# EAGLE schematic CN-Cape002 (EAGLE 7.2.0)

## Sheet 1 of 5: Spannungsversorgung Verpolungsschutz ? Größe der Sicherung ? 1A oder 3A für Servos?
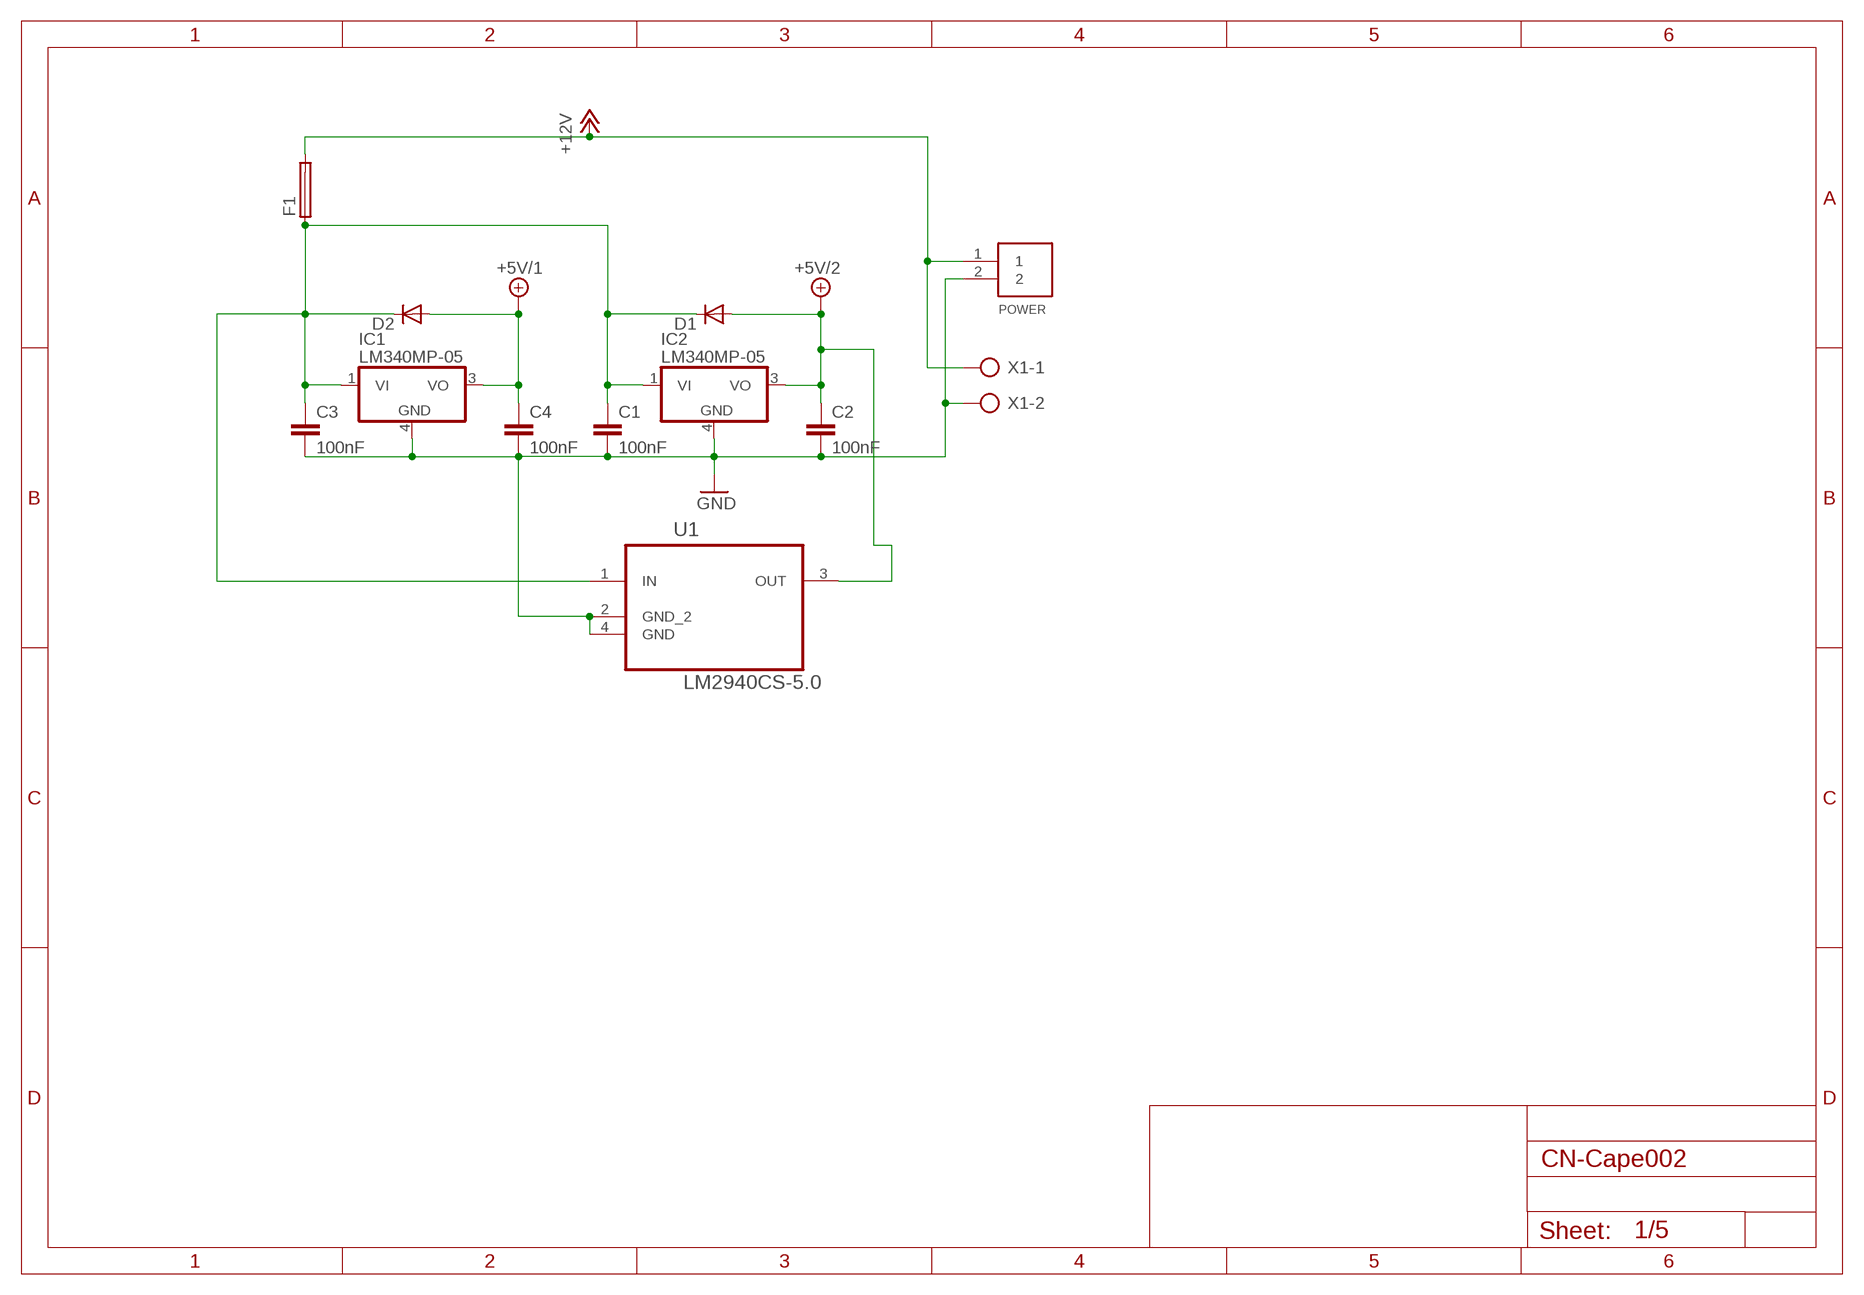
[diagram p0: schematic, sheet 1]

### Parts
C1  100nF  C-EUC0805  [C0805]
C2  100nF  C-EUC0805  [C0805]
C3  100nF  C-EUC0805  [C0805]
C4  100nF  C-EUC0805  [C0805]
D1  DIODE-SOD123  [SOD123]
D2  DIODE-SOD123  [SOD123]
F1  SH22,5  [SH22,5]
IC1  LM340MP-05  [SOT223]
IC2  LM340MP-05  [SOT223]
POWER  S2PIN  [S2B-EH]
U1  LM2940CS-5.0  [TO254P1435X464-4N]
X1  AK500/2-H  [AK500/2-H]

### Nets
12V_FUSED: C1.1 C3.1 D1.C D2.C F1.1 IC1.1(VI) IC2.1(VI) U1.1(IN)
+5V/1: C4.1 D2.A IC1.3(VO) ; also sheet 2,3,4
+5V/2: C2.1 D1.A IC2.3(VO) U1.3(OUT) ; also sheet 4,5
+12V: F1.2 POWER.1 X1.1
GND: C1.2 C2.2 C3.2 C4.2 IC1.4(GND) IC2.4(GND) POWER.2 U1.2(GND_2) U1.4(GND) X1.2 ; also sheet 2,3,4,5

## Sheet 2 of 5: BeagleBoard Black Expansion Header
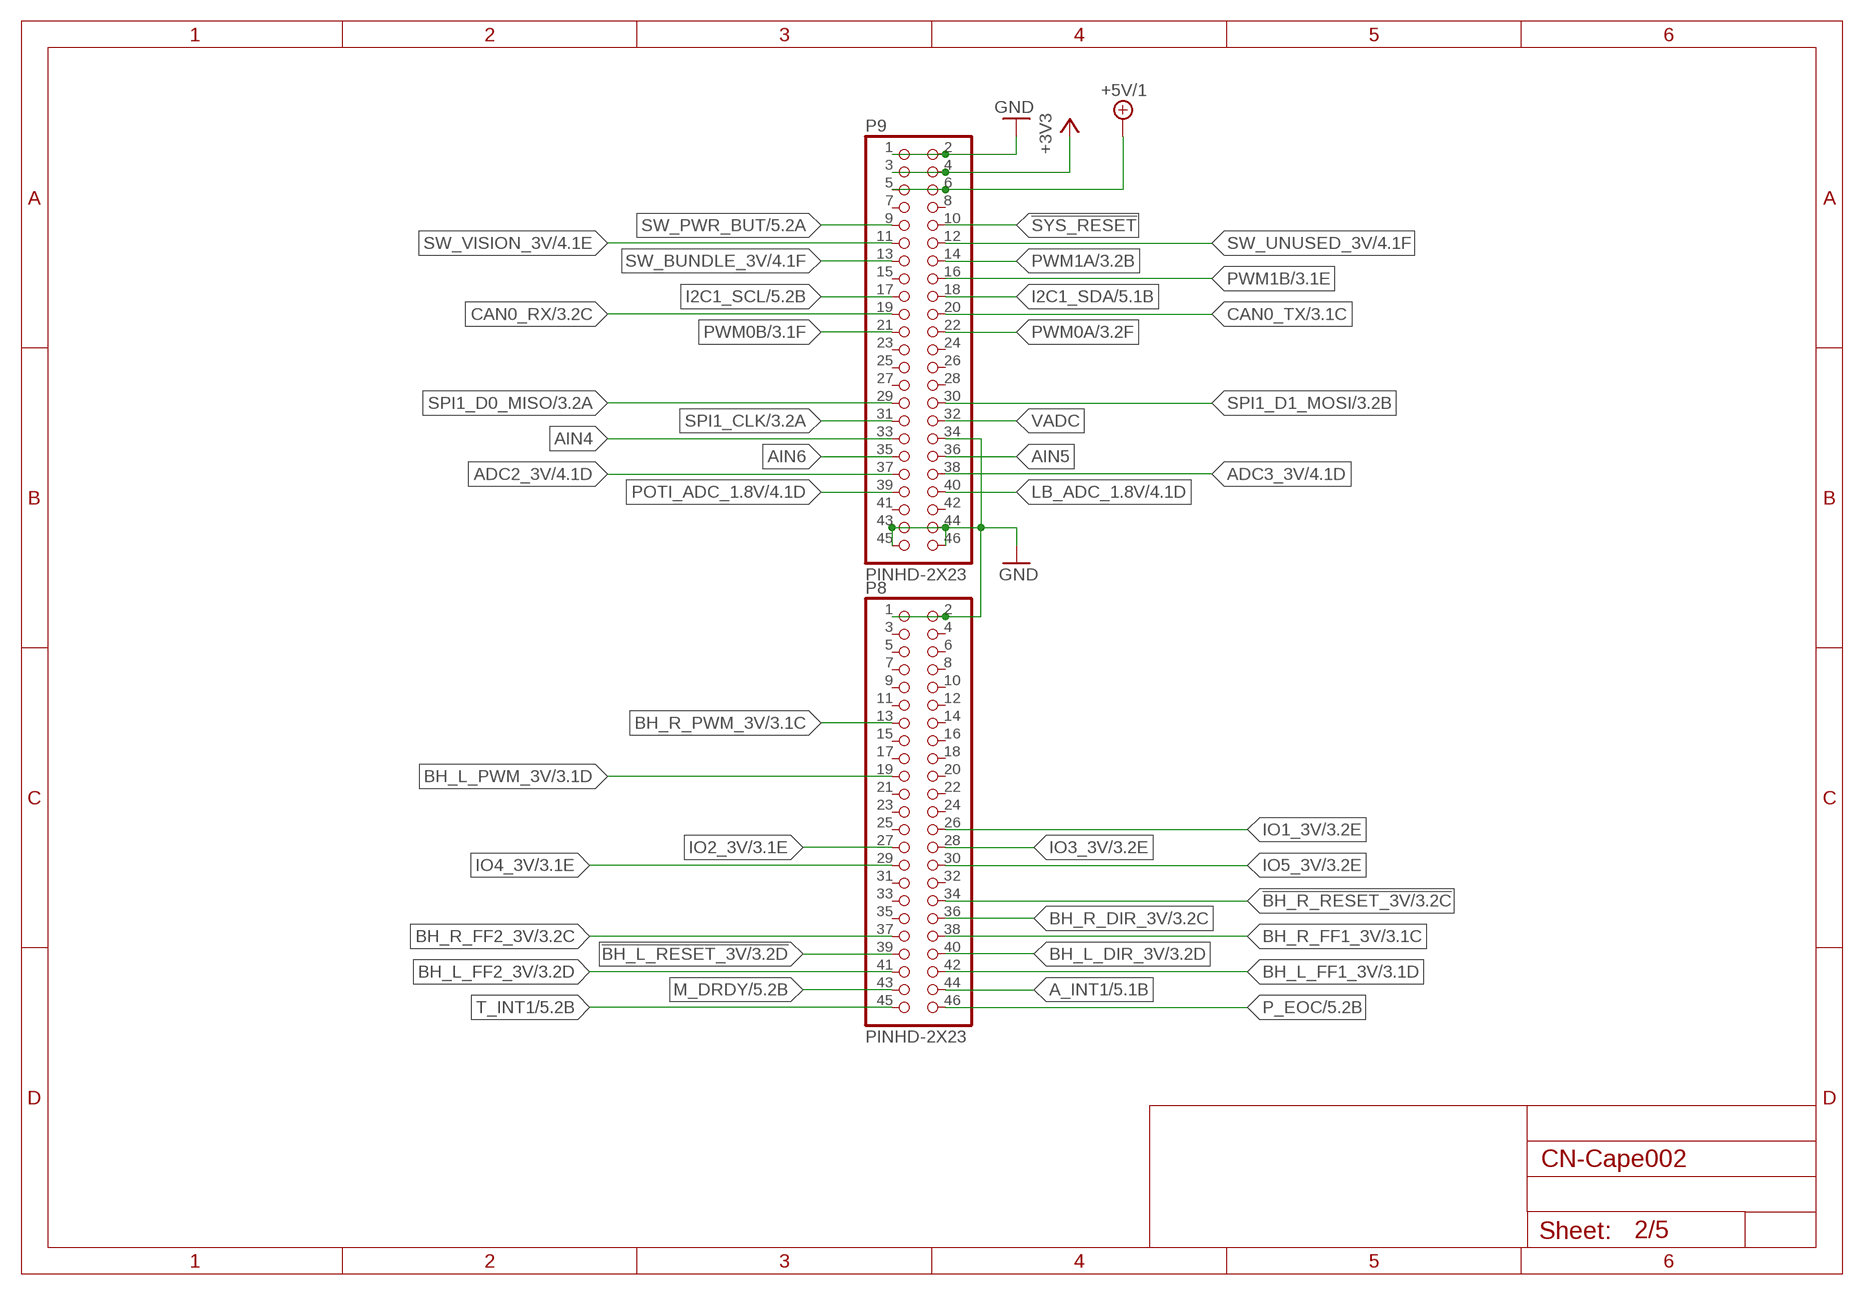
[diagram p1: schematic, sheet 2]

### Parts
P8  PINHD-2X23  [2X23]
P9  PINHD-2X23  [2X23]

### Nets
!BH_L_RESET_3V: P8.39 ; also sheet 3
!BH_R_RESET_3V: P8.34 ; also sheet 3
!SYS_RESET: P9.10
+3V3: P9.3 P9.4 ; also sheet 3,5
+5V/1: P9.5 P9.6 ; also sheet 1,3,4
A_INT1: P8.44 ; also sheet 5
ADC2_3V: P9.37 ; also sheet 4
ADC3_3V: P9.38 ; also sheet 4
AIN4: P9.33
AIN5: P9.36
AIN6: P9.35
BH_L_DIR_3V: P8.40 ; also sheet 3
BH_L_FF1_3V: P8.42 ; also sheet 3
BH_L_FF2_3V: P8.41 ; also sheet 3
BH_L_PWM_3V: P8.19 ; also sheet 3
BH_R_DIR_3V: P8.36 ; also sheet 3
BH_R_FF1_3V: P8.38 ; also sheet 3
BH_R_FF2_3V: P8.37 ; also sheet 3
BH_R_PWM_3V: P8.13 ; also sheet 3
CAN0_RX: P9.19 ; also sheet 3
CAN0_TX: P9.20 ; also sheet 3
GND: P8.1 P8.2 P9.1 P9.2 P9.34 P9.43 P9.44 P9.45 P9.46 ; also sheet 1,3,4,5
I2C1_SCL: P9.17 ; also sheet 5
I2C1_SDA: P9.18 ; also sheet 5
IO1_3V: P8.26 ; also sheet 3
IO2_3V: P8.27 ; also sheet 3
IO3_3V: P8.28 ; also sheet 3
IO4_3V: P8.29 ; also sheet 3
IO5_3V: P8.30 ; also sheet 3
LB_ADC_1.8V: P9.40 ; also sheet 4
M_DRDY: P8.43 ; also sheet 5
P_EOC: P8.46 ; also sheet 5
POTI_ADC_1.8V: P9.39 ; also sheet 4
PWM0A: P9.22 ; also sheet 3
PWM0B: P9.21 ; also sheet 3
PWM1A: P9.14 ; also sheet 3
PWM1B: P9.16 ; also sheet 3
SPI1_CLK: P9.31 ; also sheet 3
SPI1_D0_MISO: P9.29 ; also sheet 3
SPI1_D1_MOSI: P9.30 ; also sheet 3
SW_BUNDLE_3V: P9.13 ; also sheet 4
SW_PWR_BUT: P9.9 ; also sheet 5
SW_UNUSED_3V: P9.12 ; also sheet 4
SW_VISION_3V: P9.11 ; also sheet 4
T_INT1: P8.45 ; also sheet 5
VADC: P9.32
Unconnected: P8.3 P8.4 P8.5 P8.6 P8.7 P8.8 P8.9 P8.10 P8.11 P8.12 P8.14 P8.15 P8.16 P8.17 P8.18 P8.20 P8.21 P8.22 P8.23 P8.24 P8.25 P8.31 P8.32 P8.33 P8.35 P9.7 P9.8 P9.15 P9.23 P9.24 P9.25 P9.26 P9.27 P9.28 P9.41 P9.42

## Sheet 3 of 5: Level Shifter
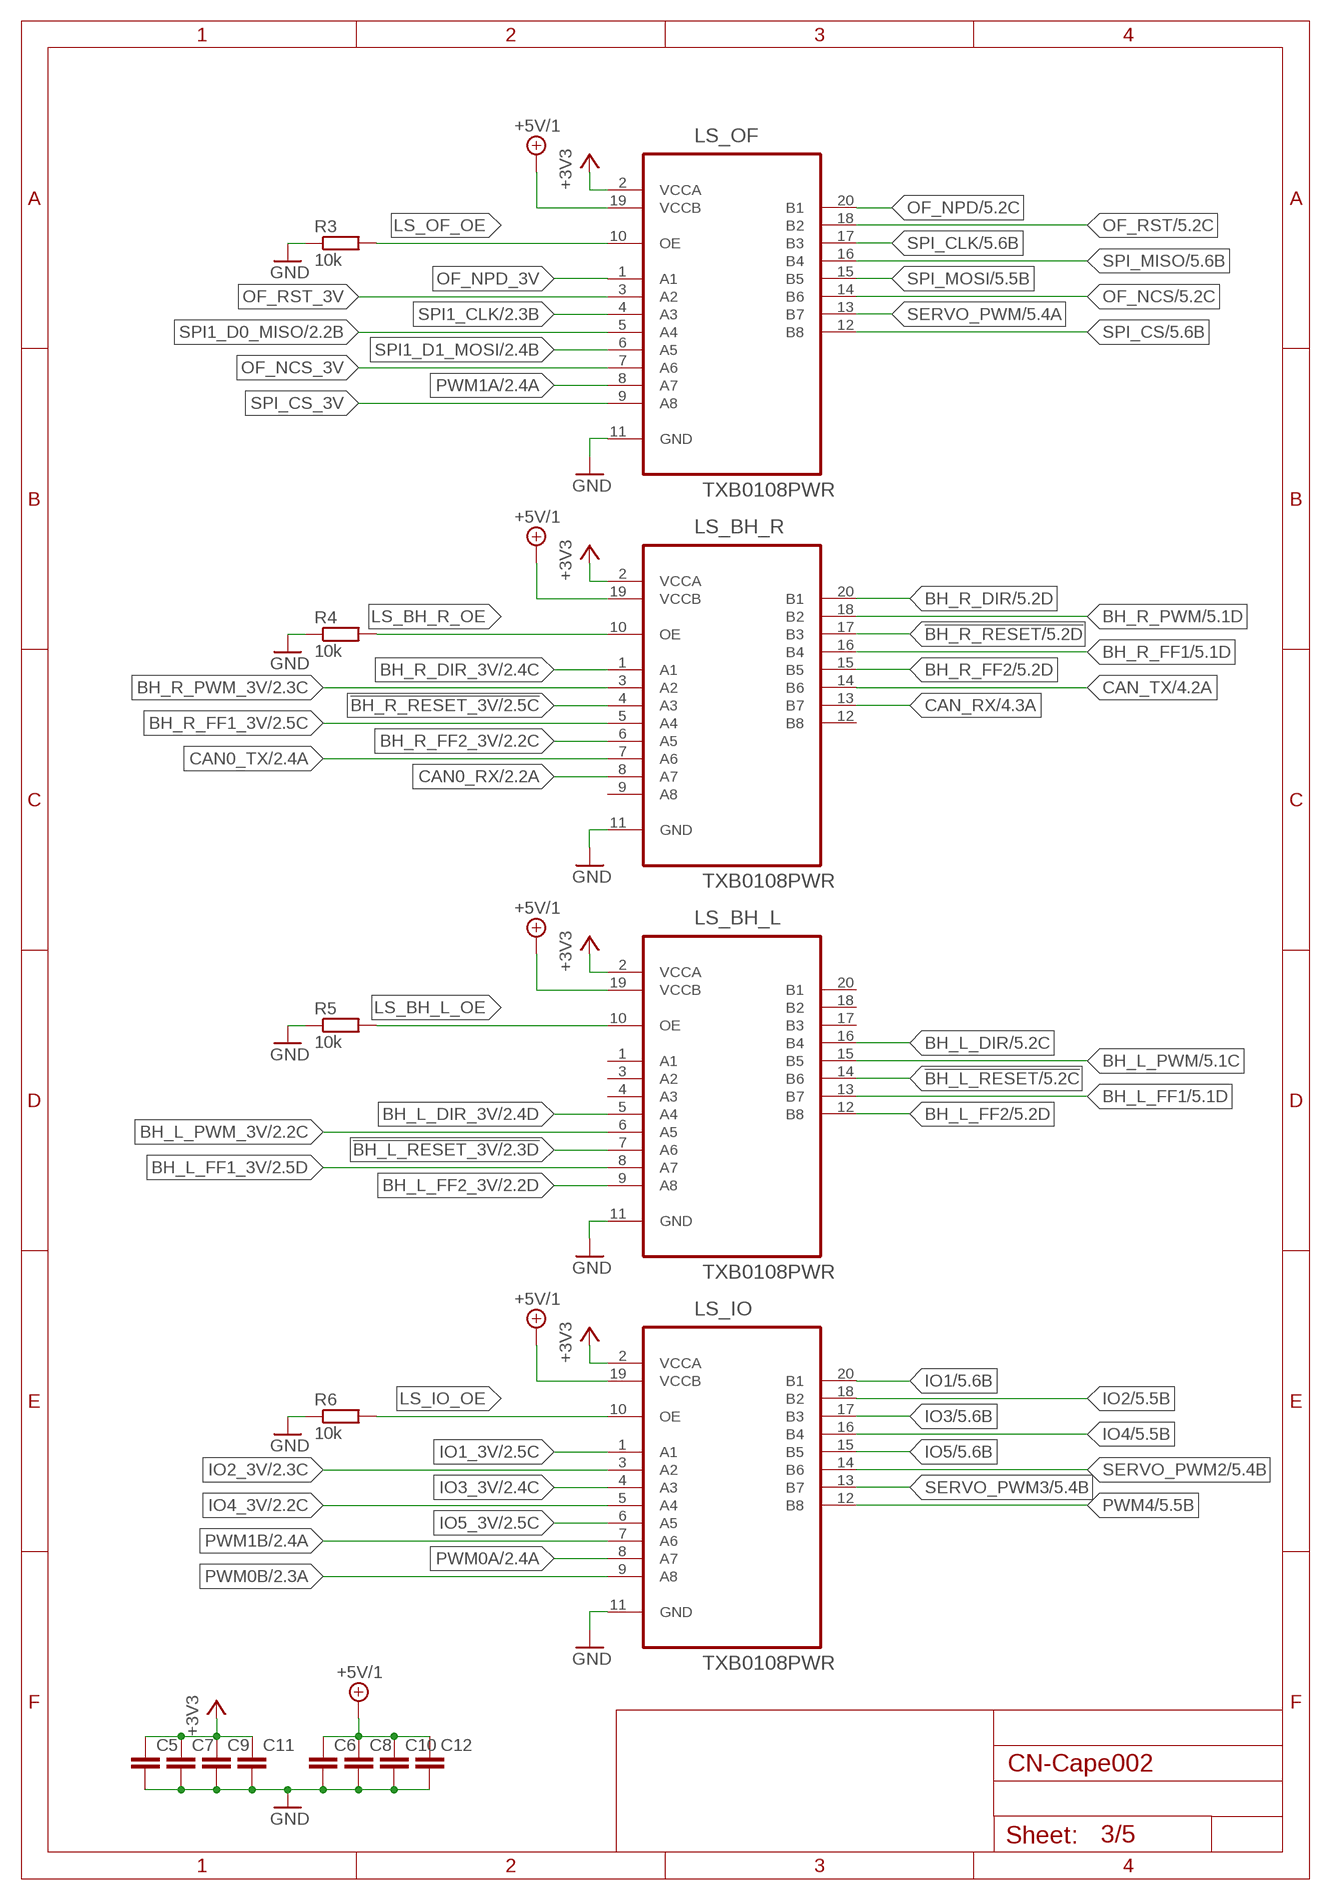
[diagram p2: schematic, sheet 3]

### Parts
C5  C-EUC0805  [C0805]
C6  C-EUC0805  [C0805]
C7  C-EUC0805  [C0805]
C8  C-EUC0805  [C0805]
C9  C-EUC0805  [C0805]
C10  C-EUC0805  [C0805]
C11  C-EUC0805  [C0805]
C12  C-EUC0805  [C0805]
LS_BH_L  TXB0108PWR  [SOP65P640X120-20N]
LS_BH_R  TXB0108PWR  [SOP65P640X120-20N]
LS_IO  TXB0108PWR  [SOP65P640X120-20N]
LS_OF  TXB0108PWR  [SOP65P640X120-20N]
R3  10k  R-EU_R0603  [R0603]
R4  10k  R-EU_R0603  [R0603]
R5  10k  R-EU_R0603  [R0603]
R6  10k  R-EU_R0603  [R0603]

### Nets
!BH_L_RESET: LS_BH_L.14(B6) ; also sheet 5
!BH_L_RESET_3V: LS_BH_L.7(A6) ; also sheet 2
!BH_R_RESET: LS_BH_R.17(B3) ; also sheet 5
!BH_R_RESET_3V: LS_BH_R.4(A3) ; also sheet 2
+3V3: C5.1 C7.1 C9.1 C11.1 LS_BH_L.2(VCCA) LS_BH_R.2(VCCA) LS_IO.2(VCCA) LS_OF.2(VCCA) ; also sheet 2,5
+5V/1: C6.1 C8.1 C10.1 C12.1 LS_BH_L.19(VCCB) LS_BH_R.19(VCCB) LS_IO.19(VCCB) LS_OF.19(VCCB) ; also sheet 1,2,4
BH_L_DIR: LS_BH_L.16(B4) ; also sheet 5
BH_L_DIR_3V: LS_BH_L.5(A4) ; also sheet 2
BH_L_FF1: LS_BH_L.13(B7) ; also sheet 5
BH_L_FF1_3V: LS_BH_L.8(A7) ; also sheet 2
BH_L_FF2: LS_BH_L.12(B8) ; also sheet 5
BH_L_FF2_3V: LS_BH_L.9(A8) ; also sheet 2
BH_L_PWM: LS_BH_L.15(B5) ; also sheet 5
BH_L_PWM_3V: LS_BH_L.6(A5) ; also sheet 2
BH_R_DIR: LS_BH_R.20(B1) ; also sheet 5
BH_R_DIR_3V: LS_BH_R.1(A1) ; also sheet 2
BH_R_FF1: LS_BH_R.16(B4) ; also sheet 5
BH_R_FF1_3V: LS_BH_R.5(A4) ; also sheet 2
BH_R_FF2: LS_BH_R.15(B5) ; also sheet 5
BH_R_FF2_3V: LS_BH_R.6(A5) ; also sheet 2
BH_R_PWM: LS_BH_R.18(B2) ; also sheet 5
BH_R_PWM_3V: LS_BH_R.3(A2) ; also sheet 2
CAN0_RX: LS_BH_R.8(A7) ; also sheet 2
CAN0_TX: LS_BH_R.7(A6) ; also sheet 2
CAN_RX: LS_BH_R.13(B7) ; also sheet 4
CAN_TX: LS_BH_R.14(B6) ; also sheet 4
GND: C5.2 C6.2 C7.2 C8.2 C9.2 C10.2 C11.2 C12.2 LS_BH_L.11(GND) LS_BH_R.11(GND) LS_IO.11(GND) LS_OF.11(GND) R3.1 R4.1 R5.1 R6.1 ; also sheet 1,2,4,5
IO1: LS_IO.20(B1) ; also sheet 5
IO1_3V: LS_IO.1(A1) ; also sheet 2
IO2: LS_IO.18(B2) ; also sheet 5
IO2_3V: LS_IO.3(A2) ; also sheet 2
IO3: LS_IO.17(B3) ; also sheet 5
IO3_3V: LS_IO.4(A3) ; also sheet 2
IO4: LS_IO.16(B4) ; also sheet 5
IO4_3V: LS_IO.5(A4) ; also sheet 2
IO5: LS_IO.15(B5) ; also sheet 5
IO5_3V: LS_IO.6(A5) ; also sheet 2
LS_BH_L_OE: LS_BH_L.10(OE) R5.2
LS_BH_R_OE: LS_BH_R.10(OE) R4.2
LS_IO_OE: LS_IO.10(OE) R6.2
LS_OF_OE: LS_OF.10(OE) R3.2
OF_NCS: LS_OF.14(B6) ; also sheet 5
OF_NCS_3V: LS_OF.7(A6)
OF_NPD: LS_OF.20(B1) ; also sheet 5
OF_NPD_3V: LS_OF.1(A1)
OF_RST: LS_OF.18(B2) ; also sheet 5
OF_RST_3V: LS_OF.3(A2)
PWM0A: LS_IO.8(A7) ; also sheet 2
PWM0B: LS_IO.9(A8) ; also sheet 2
PWM1A: LS_OF.8(A7) ; also sheet 2
PWM1B: LS_IO.7(A6) ; also sheet 2
PWM4: LS_IO.12(B8) ; also sheet 5
SERVO_PWM: LS_OF.13(B7) ; also sheet 5
SERVO_PWM2: LS_IO.14(B6) ; also sheet 5
SERVO_PWM3: LS_IO.13(B7) ; also sheet 5
SPI1_CLK: LS_OF.4(A3) ; also sheet 2
SPI1_D0_MISO: LS_OF.5(A4) ; also sheet 2
SPI1_D1_MOSI: LS_OF.6(A5) ; also sheet 2
SPI_CLK: LS_OF.17(B3) ; also sheet 5
SPI_CS: LS_OF.12(B8) ; also sheet 5
SPI_CS_3V: LS_OF.9(A8)
SPI_MISO: LS_OF.16(B4) ; also sheet 5
SPI_MOSI: LS_OF.15(B5) ; also sheet 5
Unconnected: LS_BH_L.1(A1) LS_BH_L.3(A2) LS_BH_L.4(A3) LS_BH_L.17(B3) LS_BH_L.18(B2) LS_BH_L.20(B1) LS_BH_R.9(A8) LS_BH_R.12(B8)

## Sheet 4 of 5: CAN- Bus & LED Transistoren
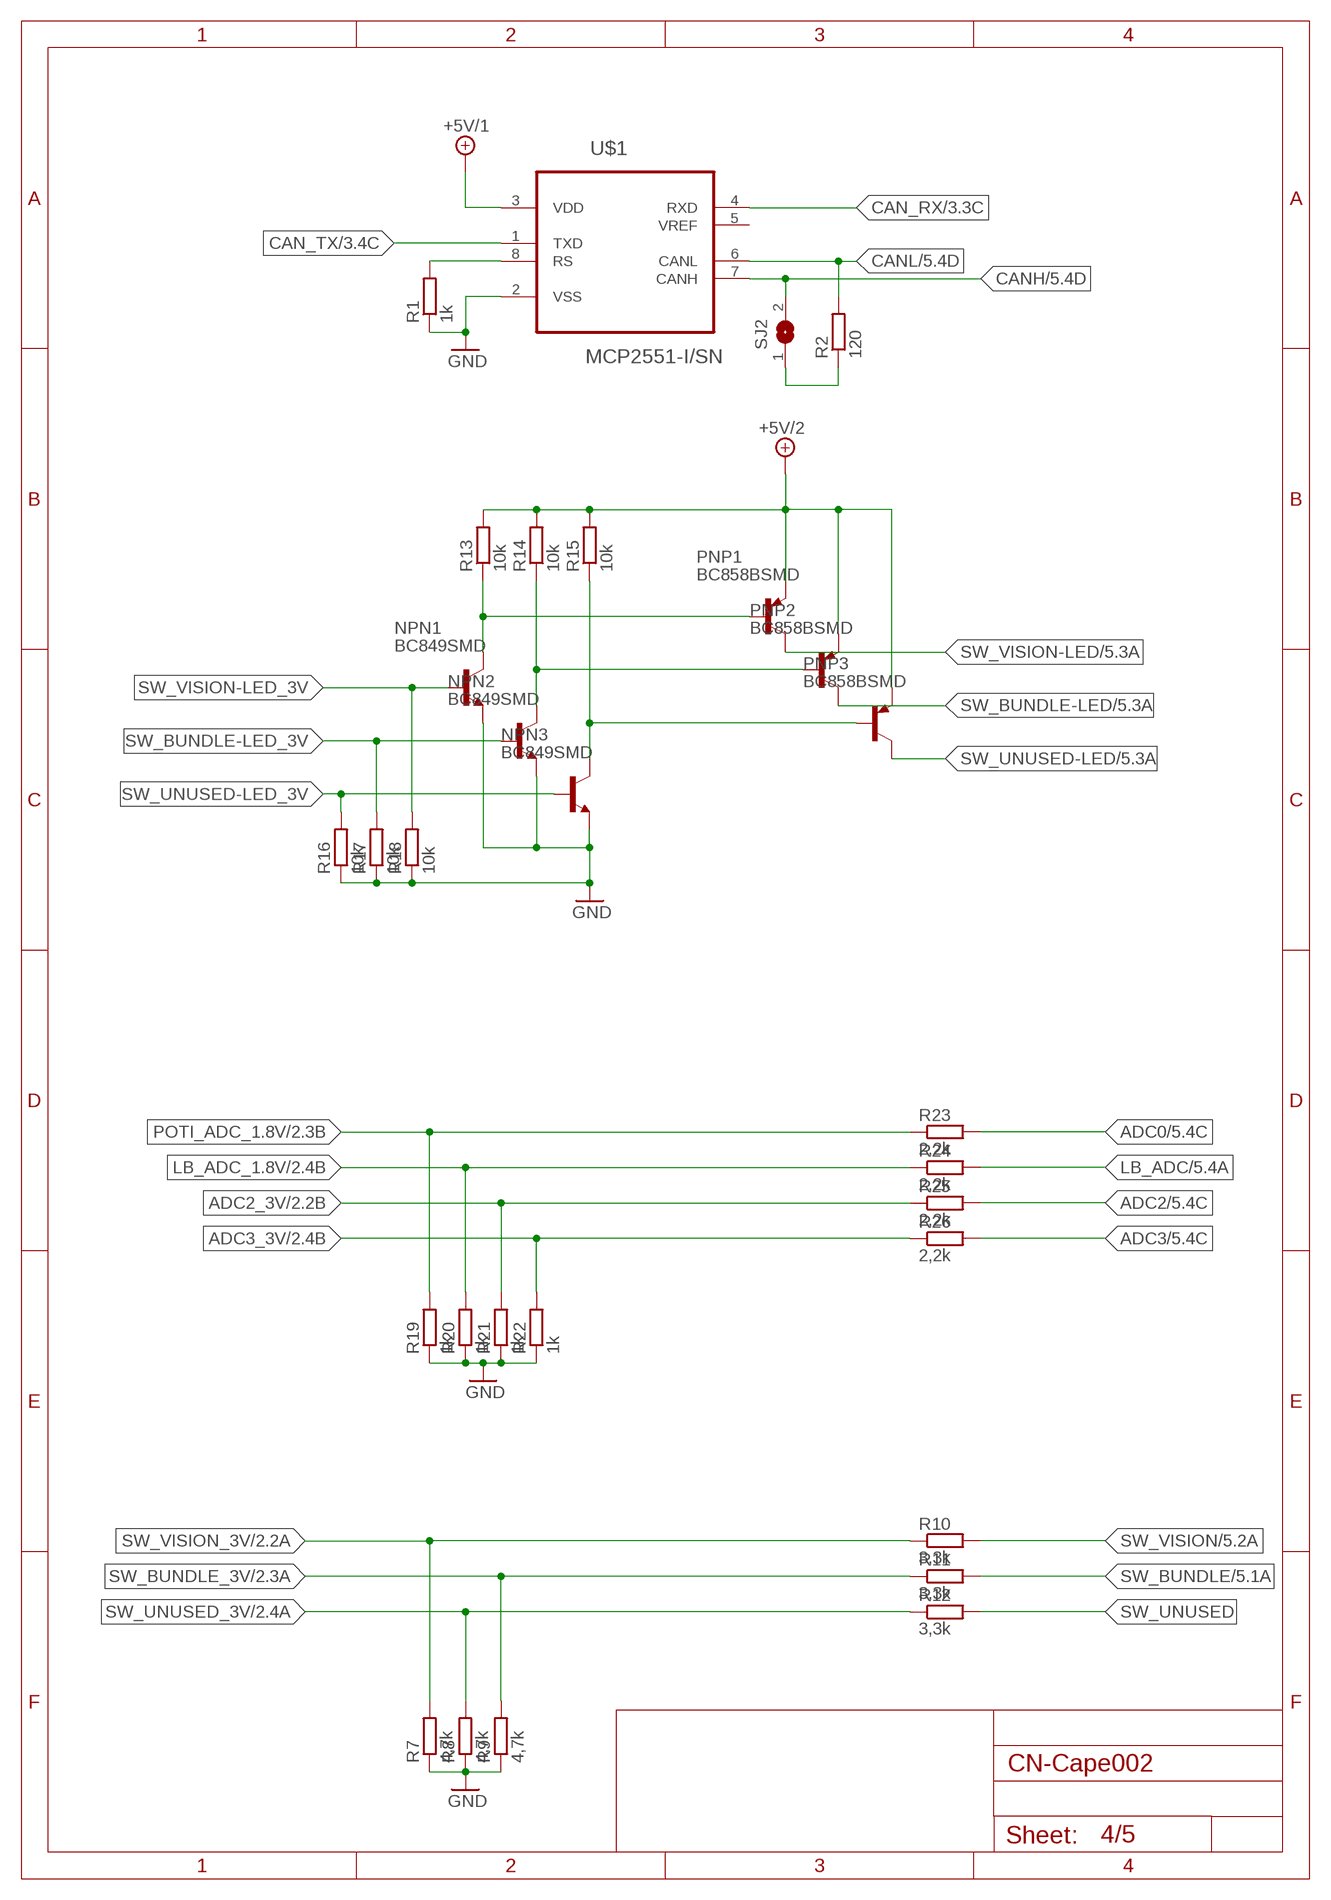
[diagram p3: schematic, sheet 4]

### Parts
NPN1  BC849SMD  [SOT23-BEC]
NPN2  BC849SMD  [SOT23-BEC]
NPN3  BC849SMD  [SOT23-BEC]
PNP1  BC858BSMD  [SOT23-BEC]
PNP2  BC858BSMD  [SOT23-BEC]
PNP3  BC858BSMD  [SOT23-BEC]
R1  1k  R-EU_R0603  [R0603]
R2  120  R-EU_R0603  [R0603]
R7  4,7k  R-EU_R0603  [R0603]
R8  4,7k  R-EU_R0603  [R0603]
R9  4,7k  R-EU_R0603  [R0603]
R10  3,3k  R-EU_R0603  [R0603]
R11  3,3k  R-EU_R0603  [R0603]
R12  3,3k  R-EU_R0603  [R0603]
R13  10k  R-EU_R0603  [R0603]
R14  10k  R-EU_R0603  [R0603]
R15  10k  R-EU_R0603  [R0603]
R16  10k  R-EU_R0603  [R0603]
R17  10k  R-EU_R0603  [R0603]
R18  10k  R-EU_R0603  [R0603]
R19  1k  R-EU_R0603  [R0603]
R20  1k  R-EU_R0603  [R0603]
R21  1k  R-EU_R0603  [R0603]
R22  1k  R-EU_R0603  [R0603]
R23  2,2k  R-EU_R0603  [R0603]
R24  2,2k  R-EU_R0603  [R0603]
R25  2,2k  R-EU_R0603  [R0603]
R26  2,2k  R-EU_R0603  [R0603]
SJ2  SJ  [SJ]
U$1  MCP2551-I/SN  [SOIC127P600X175-8N]

### Nets
+5V/1: U$1.3(VDD) ; also sheet 1,2,3
+5V/2: PNP1.E PNP2.E PNP3.E R13.2 R14.2 R15.2 ; also sheet 1,5
ADC0: R23.2 ; also sheet 5
ADC2: R25.2 ; also sheet 5
ADC2_3V: R21.2 R25.1 ; also sheet 2
ADC3: R26.2 ; also sheet 5
ADC3_3V: R22.2 R26.1 ; also sheet 2
CAN_RX: U$1.4(RXD) ; also sheet 3
CAN_TX: U$1.1(TXD) ; also sheet 3
CANH: SJ2.2 U$1.7(CANH) ; also sheet 5
CANL: R2.2 U$1.6(CANL) ; also sheet 5
GND: NPN1.E NPN2.E NPN3.E R1.1 R7.1 R8.1 R9.1 R16.1 R17.1 R18.1 R19.1 R20.1 R21.1 R22.1 U$1.2(VSS) ; also sheet 1,2,3,5
LB_ADC: R24.2 ; also sheet 5
LB_ADC_1.8V: R20.2 R24.1 ; also sheet 2
N$1: NPN1.C PNP1.B R13.1
N$2: NPN2.C PNP2.B R14.1
N$4: NPN3.C PNP3.B R15.1
N$8: R11.1
N$9: R1.2 U$1.8(RS)
N$10: R2.1 SJ2.1
POTI_ADC_1.8V: R19.2 R23.1 ; also sheet 2
SW_BUNDLE: R11.2 ; also sheet 5
SW_BUNDLE-LED: PNP2.C ; also sheet 5
SW_BUNDLE-LED_3V: NPN2.B R17.2
SW_BUNDLE_3V: R9.2 ; also sheet 2
SW_UNUSED: R12.2
SW_UNUSED-LED: PNP3.C ; also sheet 5
SW_UNUSED-LED_3V: NPN3.B R16.2
SW_UNUSED_3V: R8.2 R12.1 ; also sheet 2
SW_VISION: R10.2 ; also sheet 5
SW_VISION-LED: PNP1.C ; also sheet 5
SW_VISION-LED_3V: NPN1.B R18.2
SW_VISION_3V: R7.2 R10.1 ; also sheet 2
Unconnected: U$1.5(VREF)

## Sheet 5 of 5: Connector
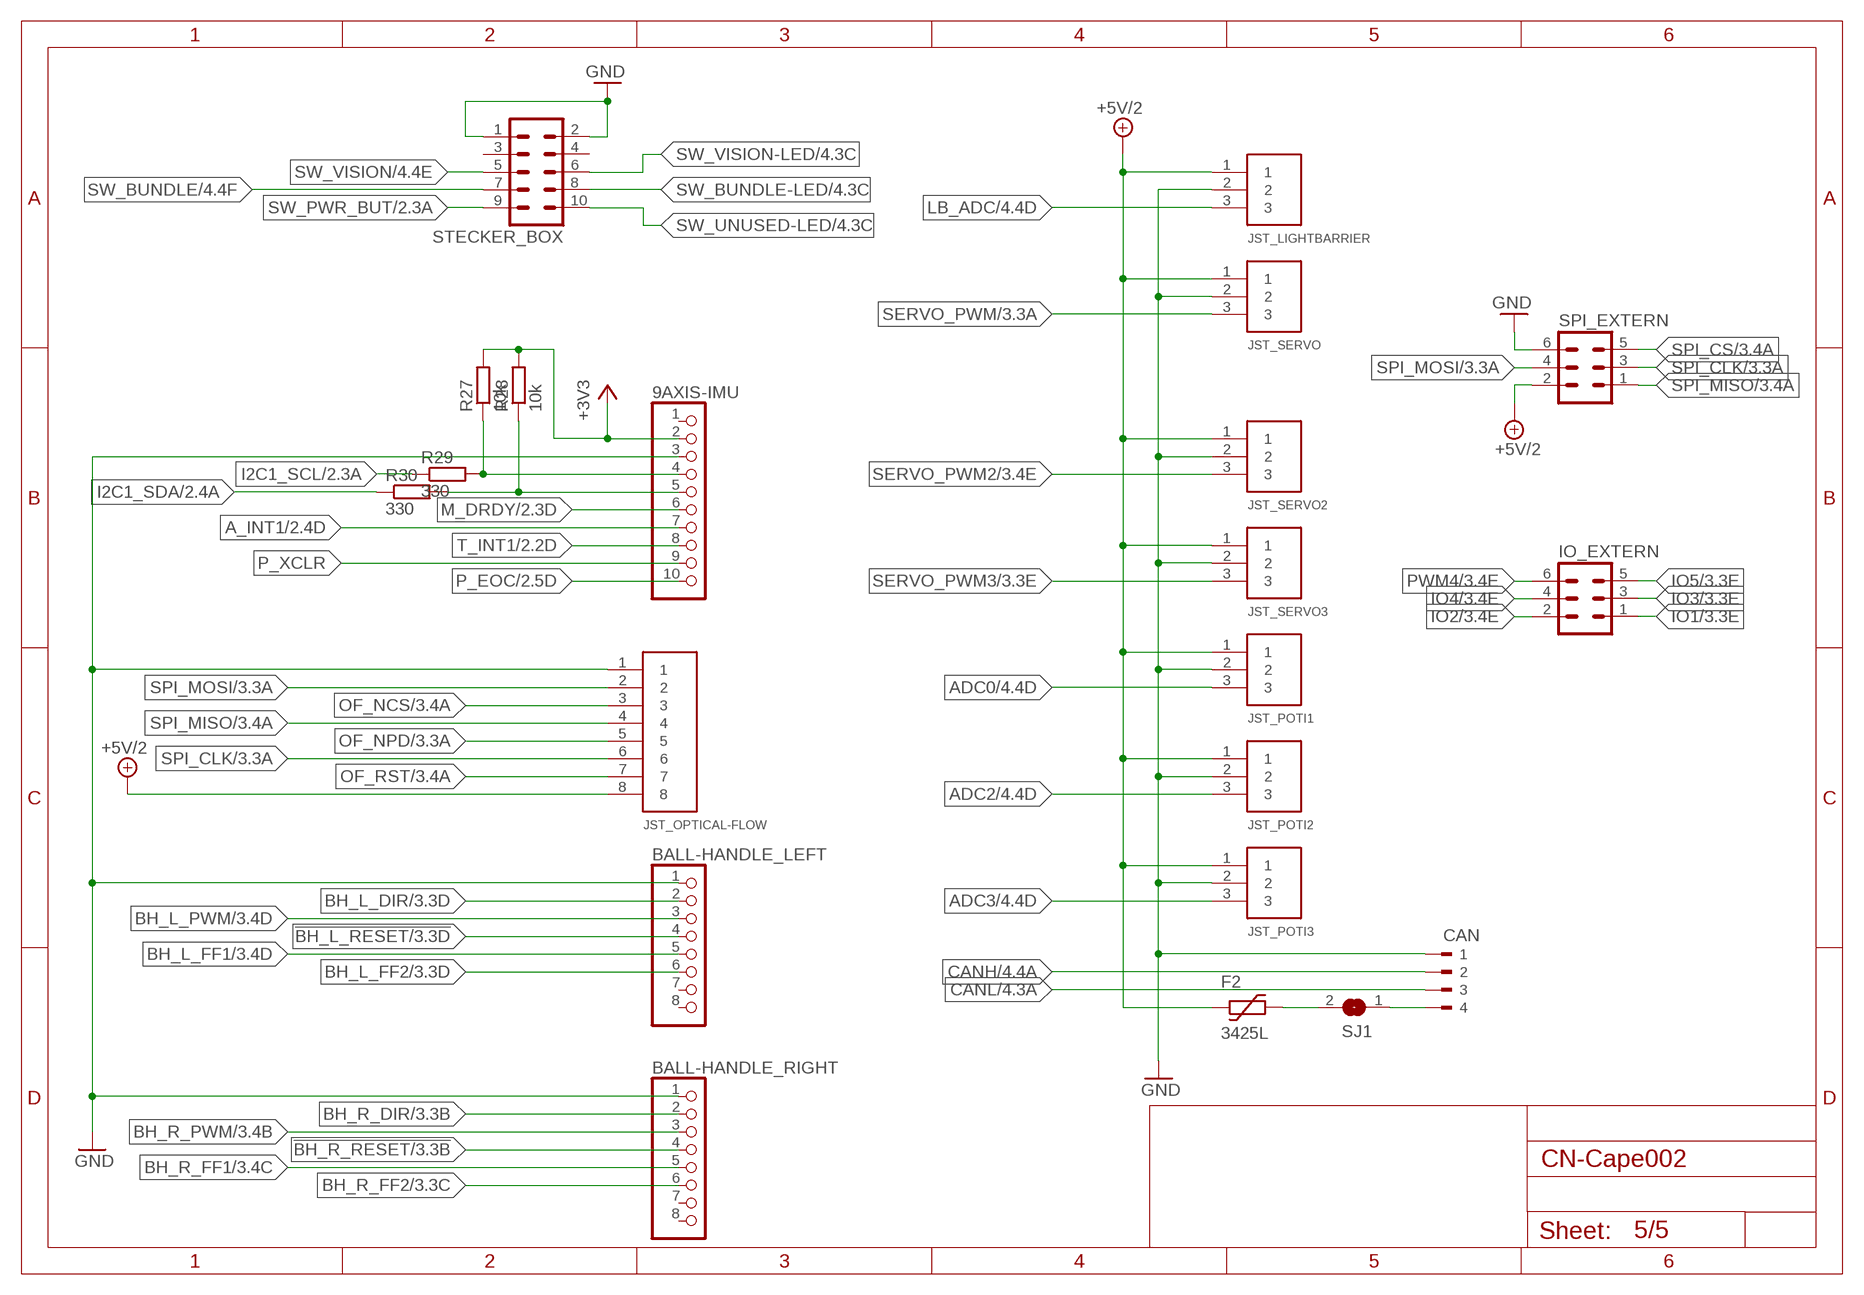
[diagram p4: schematic, sheet 5]

### Parts
9AXIS-IMU  PINHD-1X10  [1X10]
BALL-HANDLE_LEFT  PINHD-1X8  [1X08]
BALL-HANDLE_RIGHT  PINHD-1X8  [1X08]
CAN  90-4  [90-4]
F2  3425L  [3425L]
IO_EXTERN  ML6  [ML6]
JST_LIGHTBARRIER  S3PIN  [S3B-EH]
JST_OPTICAL-FLOW  S8PIN  [S8B-EH]
JST_POTI1  3PIN  [B3B-EH]
JST_POTI2  3PIN  [B3B-EH]
JST_POTI3  3PIN  [B3B-EH]
JST_SERVO  S3PIN  [S3B-EH]
JST_SERVO2  3PIN  [B3B-EH]
JST_SERVO3  3PIN  [B3B-EH]
R27  10k  R-EU_R0603  [R0603]
R28  10k  R-EU_R0603  [R0603]
R29  330  R-EU_R0603  [R0603]
R30  330  R-EU_R0603  [R0603]
SJ1  SJ  [SJ]
SPI_EXTERN  ML6  [ML6]
STECKER_BOX  ML10  [ML10]

### Nets
5V/2_F&J: CAN.4 SJ1.1
5V/2_FUSED: F2.P$2 SJ1.2
!BH_L_RESET: BALL-HANDLE_LEFT.4 ; also sheet 3
!BH_R_RESET: BALL-HANDLE_RIGHT.4 ; also sheet 3
+3V3: 9AXIS-IMU.2 R27.2 R28.2 ; also sheet 2,3
+5V/2: F2.P$1 JST_LIGHTBARRIER.1 JST_OPTICAL-FLOW.8 JST_POTI1.1 JST_POTI2.1 JST_POTI3.1 JST_SERVO2.1 JST_SERVO3.1 JST_SERVO.1 SPI_EXTERN.2 ; also sheet 1,4
A_INT1: 9AXIS-IMU.7 ; also sheet 2
ADC0: JST_POTI1.3 ; also sheet 4
ADC2: JST_POTI2.3 ; also sheet 4
ADC3: JST_POTI3.3 ; also sheet 4
BH_L_DIR: BALL-HANDLE_LEFT.2 ; also sheet 3
BH_L_FF1: BALL-HANDLE_LEFT.5 ; also sheet 3
BH_L_FF2: BALL-HANDLE_LEFT.6 ; also sheet 3
BH_L_PWM: BALL-HANDLE_LEFT.3 ; also sheet 3
BH_R_DIR: BALL-HANDLE_RIGHT.2 ; also sheet 3
BH_R_FF1: BALL-HANDLE_RIGHT.5 ; also sheet 3
BH_R_FF2: BALL-HANDLE_RIGHT.6 ; also sheet 3
BH_R_PWM: BALL-HANDLE_RIGHT.3 ; also sheet 3
CANH: CAN.2 ; also sheet 4
CANL: CAN.3 ; also sheet 4
GND: 9AXIS-IMU.3 BALL-HANDLE_LEFT.1 BALL-HANDLE_RIGHT.1 CAN.1 JST_LIGHTBARRIER.2 JST_OPTICAL-FLOW.1 JST_POTI1.2 JST_POTI2.2 JST_POTI3.2 JST_SERVO2.2 JST_SERVO3.2 JST_SERVO.2 SPI_EXTERN.6 STECKER_BOX.1 STECKER_BOX.2 ; also sheet 1,2,3,4
I2C1_SCL: R29.1 ; also sheet 2
I2C1_SDA: R30.1 ; also sheet 2
IO1: IO_EXTERN.1 ; also sheet 3
IO2: IO_EXTERN.2 ; also sheet 3
IO3: IO_EXTERN.3 ; also sheet 3
IO4: IO_EXTERN.4 ; also sheet 3
IO5: IO_EXTERN.5 ; also sheet 3
LB_ADC: JST_LIGHTBARRIER.3 ; also sheet 4
M_DRDY: 9AXIS-IMU.6 ; also sheet 2
OF_NCS: JST_OPTICAL-FLOW.3 ; also sheet 3
OF_NPD: JST_OPTICAL-FLOW.5 ; also sheet 3
OF_RST: JST_OPTICAL-FLOW.7 ; also sheet 3
P_EOC: 9AXIS-IMU.10 ; also sheet 2
P_XCLR: 9AXIS-IMU.9
PWM4: IO_EXTERN.6 ; also sheet 3
SCL: 9AXIS-IMU.4 R27.1 R29.2
SDA: 9AXIS-IMU.5 R28.1 R30.2
SERVO_PWM: JST_SERVO.3 ; also sheet 3
SERVO_PWM2: JST_SERVO2.3 ; also sheet 3
SERVO_PWM3: JST_SERVO3.3 ; also sheet 3
SPI_CLK: JST_OPTICAL-FLOW.6 SPI_EXTERN.3 ; also sheet 3
SPI_CS: SPI_EXTERN.5 ; also sheet 3
SPI_MISO: JST_OPTICAL-FLOW.4 SPI_EXTERN.1 ; also sheet 3
SPI_MOSI: JST_OPTICAL-FLOW.2 SPI_EXTERN.4 ; also sheet 3
SW_BUNDLE: STECKER_BOX.7 ; also sheet 4
SW_BUNDLE-LED: STECKER_BOX.8 ; also sheet 4
SW_PWR_BUT: STECKER_BOX.9 ; also sheet 2
SW_UNUSED-LED: STECKER_BOX.10 ; also sheet 4
SW_VISION: STECKER_BOX.5 ; also sheet 4
SW_VISION-LED: STECKER_BOX.6 ; also sheet 4
T_INT1: 9AXIS-IMU.8 ; also sheet 2
Unconnected: 9AXIS-IMU.1 BALL-HANDLE_LEFT.7 BALL-HANDLE_LEFT.8 BALL-HANDLE_RIGHT.7 BALL-HANDLE_RIGHT.8 STECKER_BOX.3 STECKER_BOX.4

## Library data of the parts
9AXIS-IMU = pinhead:PINHD-1X10: PIN HEADER
BALL-HANDLE_LEFT BALL-HANDLE_RIGHT = pinhead:PINHD-1X8: PIN HEADER
C1-C12 = rcl:C-EU: CAPACITOR, European symbol
CAN = con-weidmueller-sl35:90-4: WEIDMUELLER CLAMP CONNECTOR
D1 D2 = diode:DIODE-: DIODE; REICHELT: SD 101BW
F1 = fuse:SH22,5: FUSE HOLDER grid 22,5 mm, OGN0031 8201, Schurter (Buerklin)
F2 = ptc-littlefuse:3425L
IC1 IC2 = linear:LM340?-*: Positive VOLTAGE REGULATOR Source: http://cache.national.com/ds/LM/LM340.pdf
IO_EXTERN SPI_EXTERN = con-ml:ML6: HARTING
JST_LIGHTBARRIER JST_SERVO = jst_eh:S3PIN
JST_OPTICAL-FLOW = jst_eh:S8PIN
JST_POTI1-JST_POTI3 JST_SERVO2 JST_SERVO3 = jst_eh:3PIN
LS_BH_L LS_BH_R LS_IO LS_OF = TI-TXB0108PWR:TXB0108PWR: 8-BIT BIDIRECTIONAL VOLTAGE-LEVEL TRANSLATOR; MPN: TXB0108PWR; OC_FARNELL: 1494945; OC_NEWARK: 27M1151; PACKAGE: TSSOP-20; SUPPLIER: Texas Instruments
NPN1-NPN3 = transistor-npn:BC849*: NPN Transistor
P8 P9 = pinhead-2x23:PINHD-2X23
PNP1-PNP3 = transistor-pnp:BC858*: PNP Transistror
POWER = jst_eh:S2PIN
R1-R30 = rcl:R-EU_: RESISTOR, European symbol
SJ1 SJ2 = jumper:SJ: SMD solder JUMPER
STECKER_BOX = con-ml:ML10: HARTING
U1 = LM2940CS:LM2940CS-5.0: Dropout Regulator; MPN: LM2940CS-5.0; OC_FARNELL: 9779850; OC_NEWARK: 07B6352; PACKAGE: TO-263-3; SUPPLIER: NationalSemiconductor
U$1 = Microchip-MCP2551-I_SN:MCP2551-I/SN: High-Speed CAN Transceiver; MPN: MCP2551-I/SN; OC_FARNELL: 9758569; OC_NEWARK: 69K7604; PACKAGE: SOIC-8; SUPPLIER: Microchip
X1 = con-ptr500:AK500/2-H: CONNECTOR Aug. 2004 / PTR Meßtechnik: Die Bezeichnung der Serie AK505 wurde geändert. Es handelt sich hierbei um AK500 in horizontaler Ausführung.